# Altium schematic sheet Primary.SCHDOC
size 297 x 209 mm; SheetNumber: 1; SheetTotal: 1; DocumentName: Primary.SCHDOC
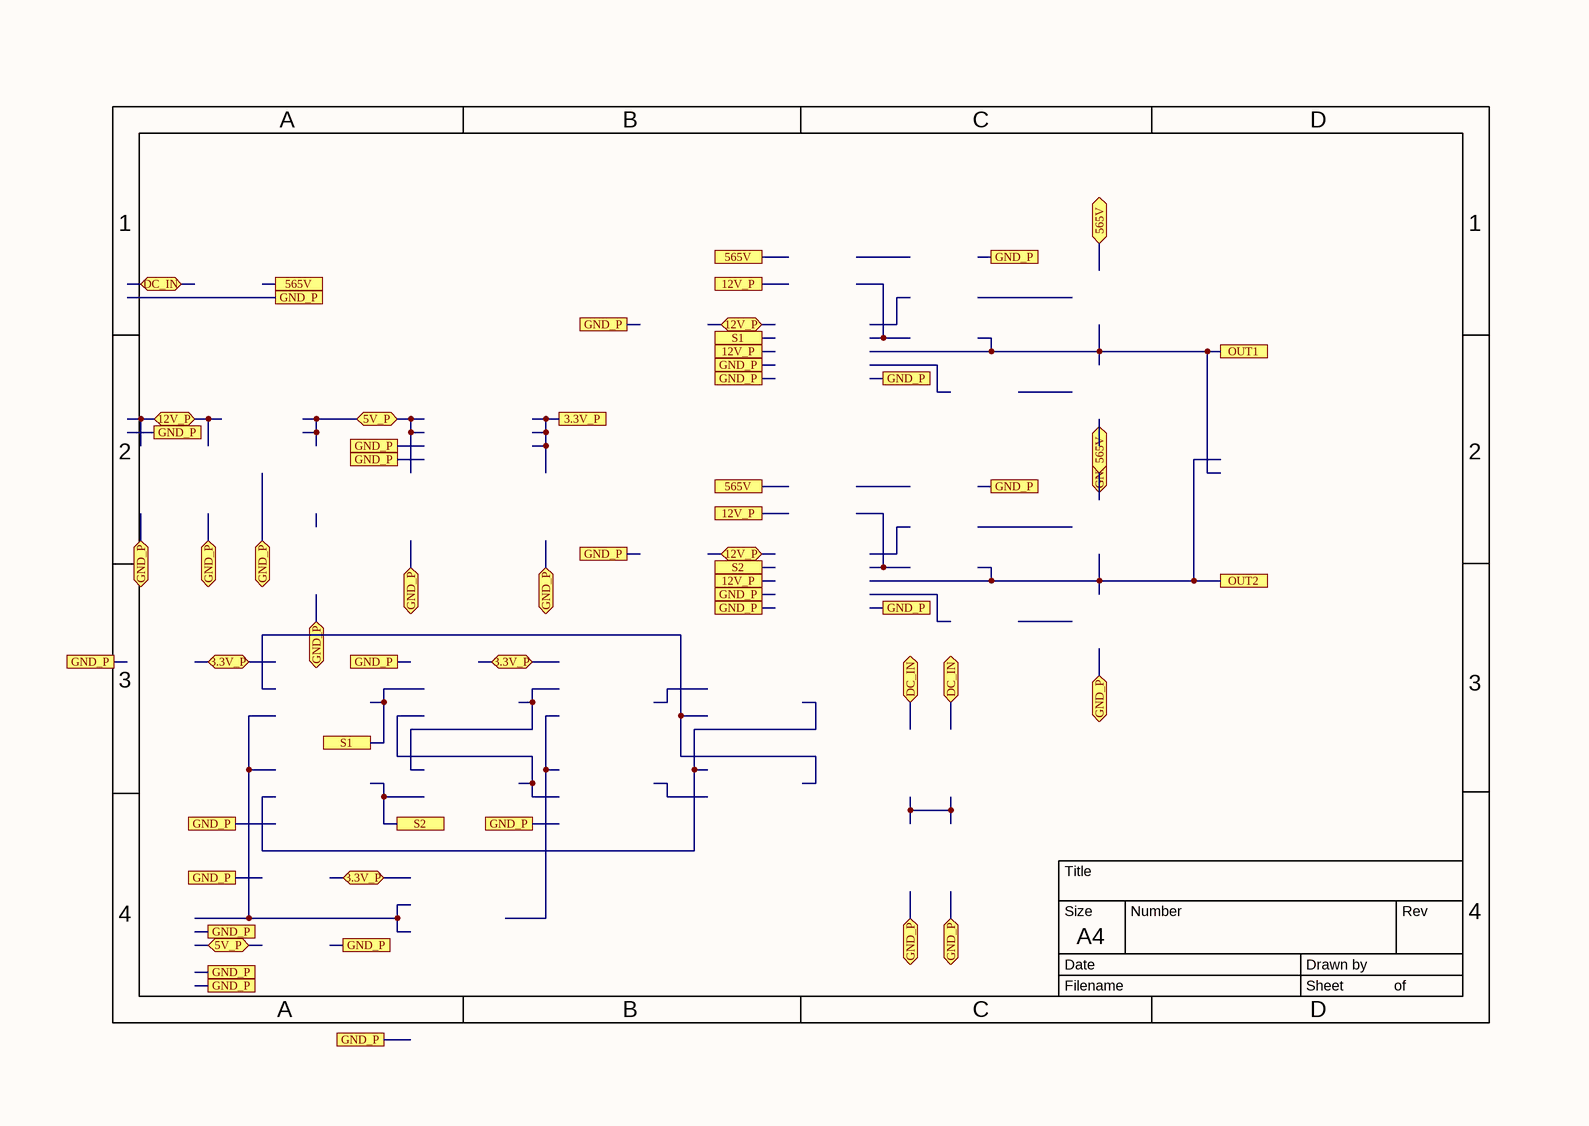
[diagram p0: Primary.SCHDOC]

## Ports
3.3V_P, 3.3V_P (bidir), 5V_P (bidir), 12V_P, 12V_P (bidir), 565V, DC_IN, DC_IN (bidir), GND_P, OUT1, OUT2, S1, S2

## Nets
565V: port GND_P, port 565V

## Notes on the sheet
- A
- B
- C
- D
- 1
- 2
- 3
- Title
- 4
- Size
- A4
- Number
- Rev
- Date
- Filename
- Drawn by
- Sheet
- of